# EAGLE design LTC3111_buck-boost (EAGLE 6.3)
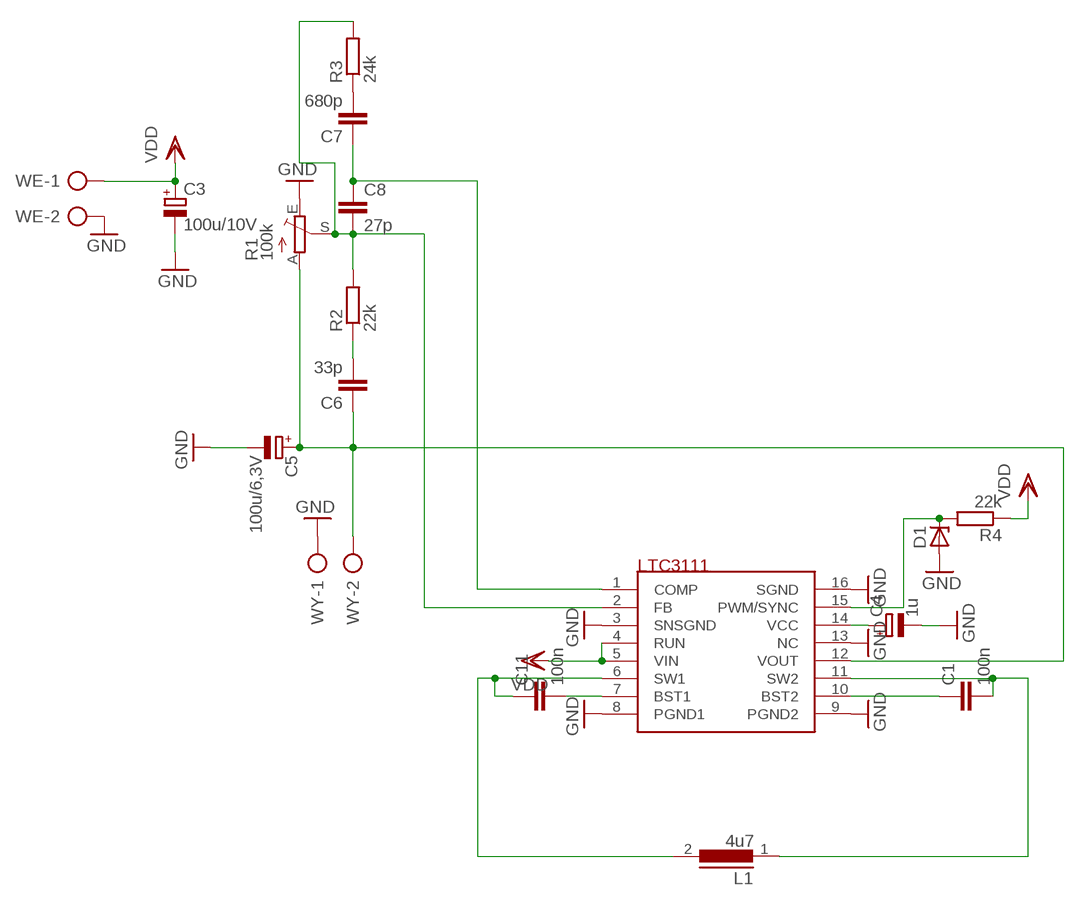
[diagram p0: schematic, sheet 1]

## Parts
C1  100n  C-EUC0603K  [C0603K]
C3  100u/10V  CPOL-EUE2.5-6  [E2,5-6]
C4  1u  CPOL-EUE2.5-6  [E2,5-6]
C5  100u/6,3V  CPOL-EUE2.5-7  [E2,5-7]
C6  33p  C-EUC0805  [C0805]
C7  680p  C-EUC0805  [C0805]
C8  27p  C-EUC0805  [C0805]
C11  100n  C-EUC0603K  [C0603K]
D1  ZENER-DIODESOD80C  [SOD80C]
L1  4u7  DR73  [DR73]
R1  100k  TRIM_EU-RJ9W  [RJ9W]
R2  22k  R-EU_R0805  [R0805]
R3  24k  R-EU_R0805  [R0805]
R4  22k  R-EU_R0805  [R0805]
U$2  LTC3111  [MSOP16]
WE  AK300/2  [AK300/2]
WY  AK300/2  [AK300/2]

## Nets
GND: C3.- C4.- C5.- D1.A R1.E U$2.3(SNSGND) U$2.8(PGND1) U$2.9(PGND2) U$2.13(NC) U$2.16(SGND) WE.2 WY.1
N$1: C1.1 U$2.10(BST2)
N$3: C4.+ U$2.14(VCC)
N$4: C1.2 L1.1 U$2.11(SW2)
N$6: C6.2 R2.1
N$7: C5.+ C6.1 R1.A U$2.12(VOUT) WY.2
N$8: C8.2 R1.S R2.2 R3.2 U$2.2(FB)
N$9: C7.2 R3.1
N$10: C7.1 C8.1 U$2.1(COMP)
N$12: C11.1 L1.2 U$2.6(SW1)
N$13: C11.2 U$2.7(BST1)
N$16: D1.C R4.2 U$2.15(PWM/SYNC)
VDD: C3.+ R4.1 U$2.4(RUN) U$2.5(VIN) WE.1

## Library data of the parts
C1 C6-C8 C11 = resistor:C-EU: CAPACITOR, European symbol
C3-C5 = rcl:CPOL-EU: POLARIZED CAPACITOR, European symbol
D1 = diode:ZENER-DIODE: Z-Diode
L1 = inductors:DR73: High Power Density, High Efficiency, Shielded Inductors Source: coiltronics_dr_series.pdf
R1 = pot:TRIM_EU-: POTENTIOMETER
R2-R4 = resistor:R-EU_: RESISTOR, European symbol
U$2 = ref-packages:LTC3111
WE WY = con-ptr500:AK300/2: CONNECTOR; OC_FARNELL: unknown; OC_NEWARK: unknown

## Net classes
0 default: clearance 0.6 mm

## Board
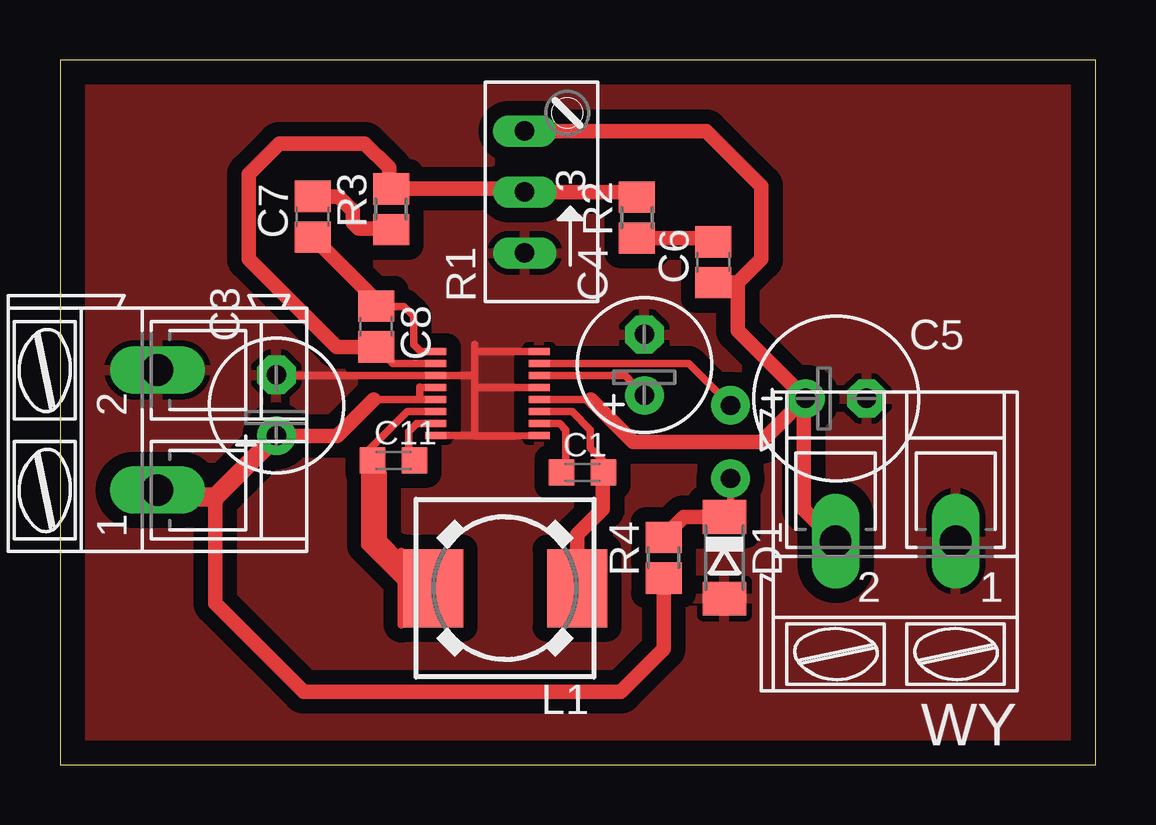
[diagram p1: board, top side]
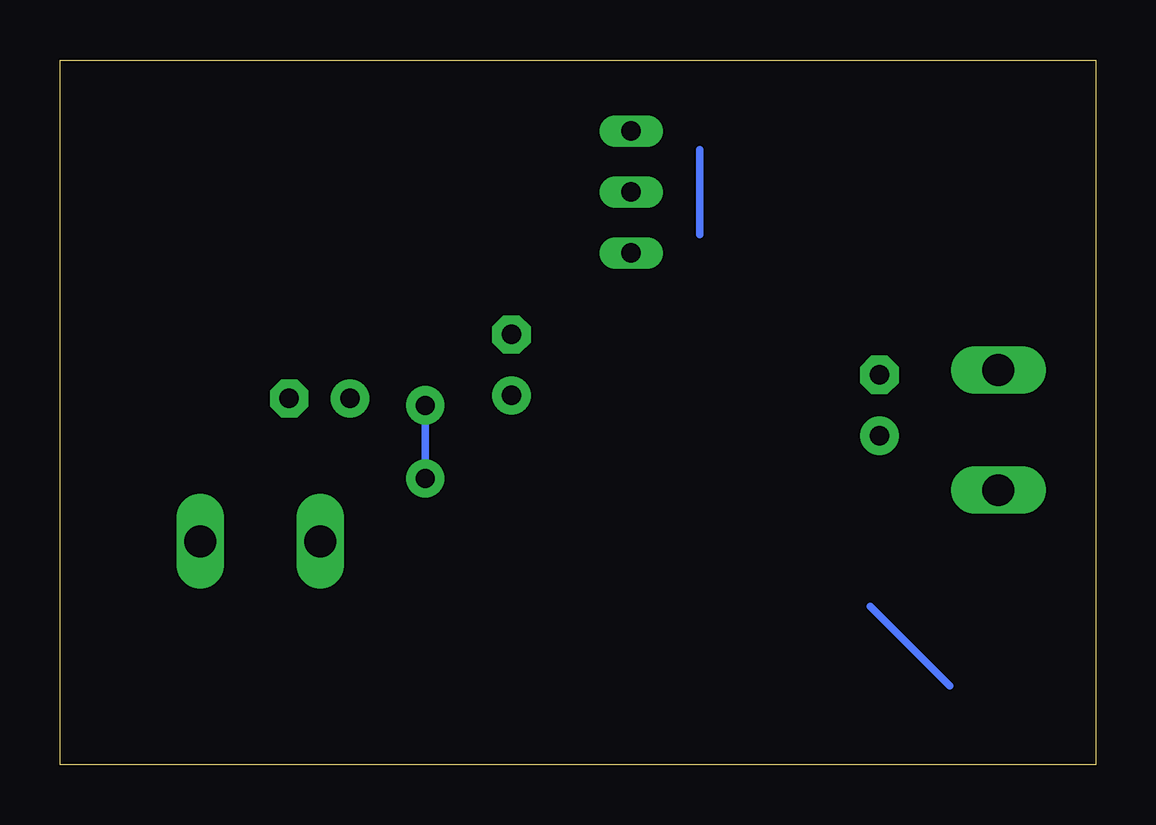
[diagram p2: board, bottom side, seen from below]

Size 43.16 x 29.39 mm. Coordinates in mm from the lower left corner, seen from the top.
Outline: 0,0 43.16,0 43.16,29.39 0,29.39 0,0
Copper layers (1*16): Top 0.035mm / dielectric 1.5mm / Bottom 0.035mm
Design rules "default": minimum track width 10mil, minimum drill 24mil, track to track 8mil, track to pad 8mil, pad to pad 8mil, via to via 8mil, smd to smd 8mil, copper to edge 40mil, drill to drill 8mil, minimum pad ring 10mil, minimum via ring 8mil, stop-mask expansion 4mil, vias tented up to drill 0mil, thermal gap 10mil

### Footprints (pad centres in the part's own frame; a part is rotated, then mirrored left to right if it is on the bottom)
C0603K = smd 1.05 x 1.08: 1 -0.875,0; 2 0.875,0
E2,5-6 = drill 0.813 pad 1.6: + -1.27,0 | drill 0.813 pad 1.6 octagon: - 1.27,0
E2,5-7 = drill 0.813 pad 1.6: + -1.27,0 | drill 0.813 pad 1.6 octagon: - 1.27,0
C0805 = smd 1.3 x 1.5: 1 -0.85,0; 2 0.85,0
SOD80C = smd 1.4 x 1.8: A 1.7,0; C -1.7,0
DR73 = smd 2.5 x 3.25: 1 -3,0; 2 3,0
RJ9W = drill 0.813 long: A 2.54,0.635; E -2.54,0.635; S 0,0.635
R0805 = smd 1.3 x 1.5: 1 -0.85,0; 2 0.85,0
MSOP16 = smd 0.889 x 0.305: 1 -1.615,1.609; 2 -1.615,1.109; 3 -1.615,0.609; 4 -1.615,0.109; 5 -1.615,-0.391; 6 -1.615,-0.891; 7 -1.615,-1.391; 8 -1.615,-1.891; 9 2.695,-1.891; 10 2.695,-1.391; 11 2.695,-0.891; 12 2.695,-0.391; 13 2.695,0.109; 14 2.695,0.609; 15 2.695,1.109; 16 2.695,1.609
AK300/2 = drill 1.321 long: 1 -2.515,0; 2 2.489,0

### Placement (x,y rotation side)
C1  21.77,12.19 0 top
C3  9.02,14.99 90 top
C4  24.35,16.67 90 top
C5  32.34,15.27 0 top
C6  27.22,20.96 90 top
C7  10.52,22.85 90 top
C8  13.17,18.28 270 top
C11  13.89,12.69 0 top
D1  27.69,8.64 270 top
L1  18.54,7.37 180 top
R1  20,23.88 90 top
R2  24.04,22.82 90 top
R3  13.8,23.17 90 top
R4  25.15,8.64 90 top
U$2  17.27,15.62 0 top
WE  4.06,13.97 90 top
WY  34.81,9.32 180 top

### Tracks (layer width: path | path; a pad name or v marks a point on that pad's centre or on a via)
GND
  Top 0.305: 17.27,13.73 17.27,13.72 18.96,13.72 U$2.9 | U$2.8 17.27,13.73 | 17.27,13.73 17.27,15.73 | 17.27,15.73 17.27,16.23 | 17.27,16.23 U$2.3 9.04,16.23 C3.- | U$2.16 17.27,17.23 | 17.27,17.23 17.27,17.53 | 17.27,17.23 17.27,16.23 | U$2.13 17.27,15.73
  pour Top: -9.4,-1.52 43.31,-1.52 43.31,38.48 -9.4,38.48
N$1
  Top 0.305: U$2.10 20.82,14.23 21.08,13.97 21.08,12.26 C1.1
N$2
  Top 0.305: 14.73,8.64 14.22,8.64 13.46,9.4 13.46,12.19
N$3
  Top 0.305: U$2.14 23.54,16.23 C4.+
N$4
  Top 0.305: U$2.11 21.34,14.73 22.1,13.97 22.1,13.21 22.61,12.7 22.61,12.23 C1.2 22.61,12.15
  Top 0.61: L1.1 21.54,9.6 22.61,10.67 22.61,12.15
N$5
  Top 0.305: 12.7,12.19 12.7,9.14 14.22,7.62
N$6
  Top 0.61: R2.1 27.06,21.97 C6.2
N$7
  Top 0.305: U$2.12 22.11,15.23 | C5.+ 29.26,13.46 29.26,13.51
  Top 0.61: C6.1 28.23,20.11 | 28.23,20.11 29.21,21.08 29.21,24.13 26.92,26.42 22.16,26.42 R1.A | 28.23,20.11 28.23,18.11 C5.+ | 22.11,15.23 23.88,13.46 29.26,13.46 | 29.26,13.51 30.99,15.24 30.99,10.65 WY.2
N$8
  Top 0.305: U$2.2 13.87,16.73 C8.2
  Top 0.61: R2.2 23.83,23.88 R1.S 19.22,24.02 R3.2 13.72,24.1 13.72,24.89 12.7,25.91 9.14,25.91 7.87,24.64 7.87,21.08 11.53,17.43 C8.2
N$9
  Top 0.61: C7.2 11.61,23.7 12.19,23.11 12.19,22.61 12.45,22.35 13.76,22.35 R3.1
N$10
  Top 0.305: U$2.1 15.03,17.23 14.73,17.53 14.73,18.7 14.33,19.11 13.19,19.11 C8.1
  Top 0.406: C8.1 13.17,19.35
  Top 0.61: 13.17,19.35 C7.1
N$11
  Top 0.305: 14.22,8.89 14.22,5.84
N$12
  Top 0.305: U$2.6 14.48,14.73 12.83,13.08 C11.1 13.03,12.68 | L1.2 14.99,7.37
  Top 0.61: 14.99,7.37 13.03,9.33 13.03,12.68
N$13
  Top 0.305: U$2.7 14.87,14.23 14.53,13.9 14.53,12.93 C11.2
N$16  (via drill 0.8 pad 1.6)
  Top 0.305: U$2.15 26.2,16.73 v27.94,14.99 | v27.94,11.94 27.94,10.59 D1.C
  Top 0.61: D1.C 26,10.34 R4.2
  Bottom 0.305: v27.94,14.99 v27.94,11.94
N$17
  Bottom 0.305: 16.51,22.1 16.51,25.65
N$18
  Bottom 0.305: 6.1,3.3 9.4,6.6
VDD
  Top 0.305: U$2.5 14.99,15.23 | 14.99,15.23 13.07,15.23 | 4.34,11.18 WE.1 | U$2.4 15,15.73 14.99,15.75 14.99,15.23
  Top 0.61: 13.07,15.23 11.56,13.72 C3.+ | 6.48,11.18 6.48,6.73 10.16,3.05 23.37,3.05 25.15,4.83 R4.1
  Top 0.813: C3.+ 6.48,11.18 4.34,11.18